# EAGLE schematic SensorBoard (EAGLE 9.1.3)
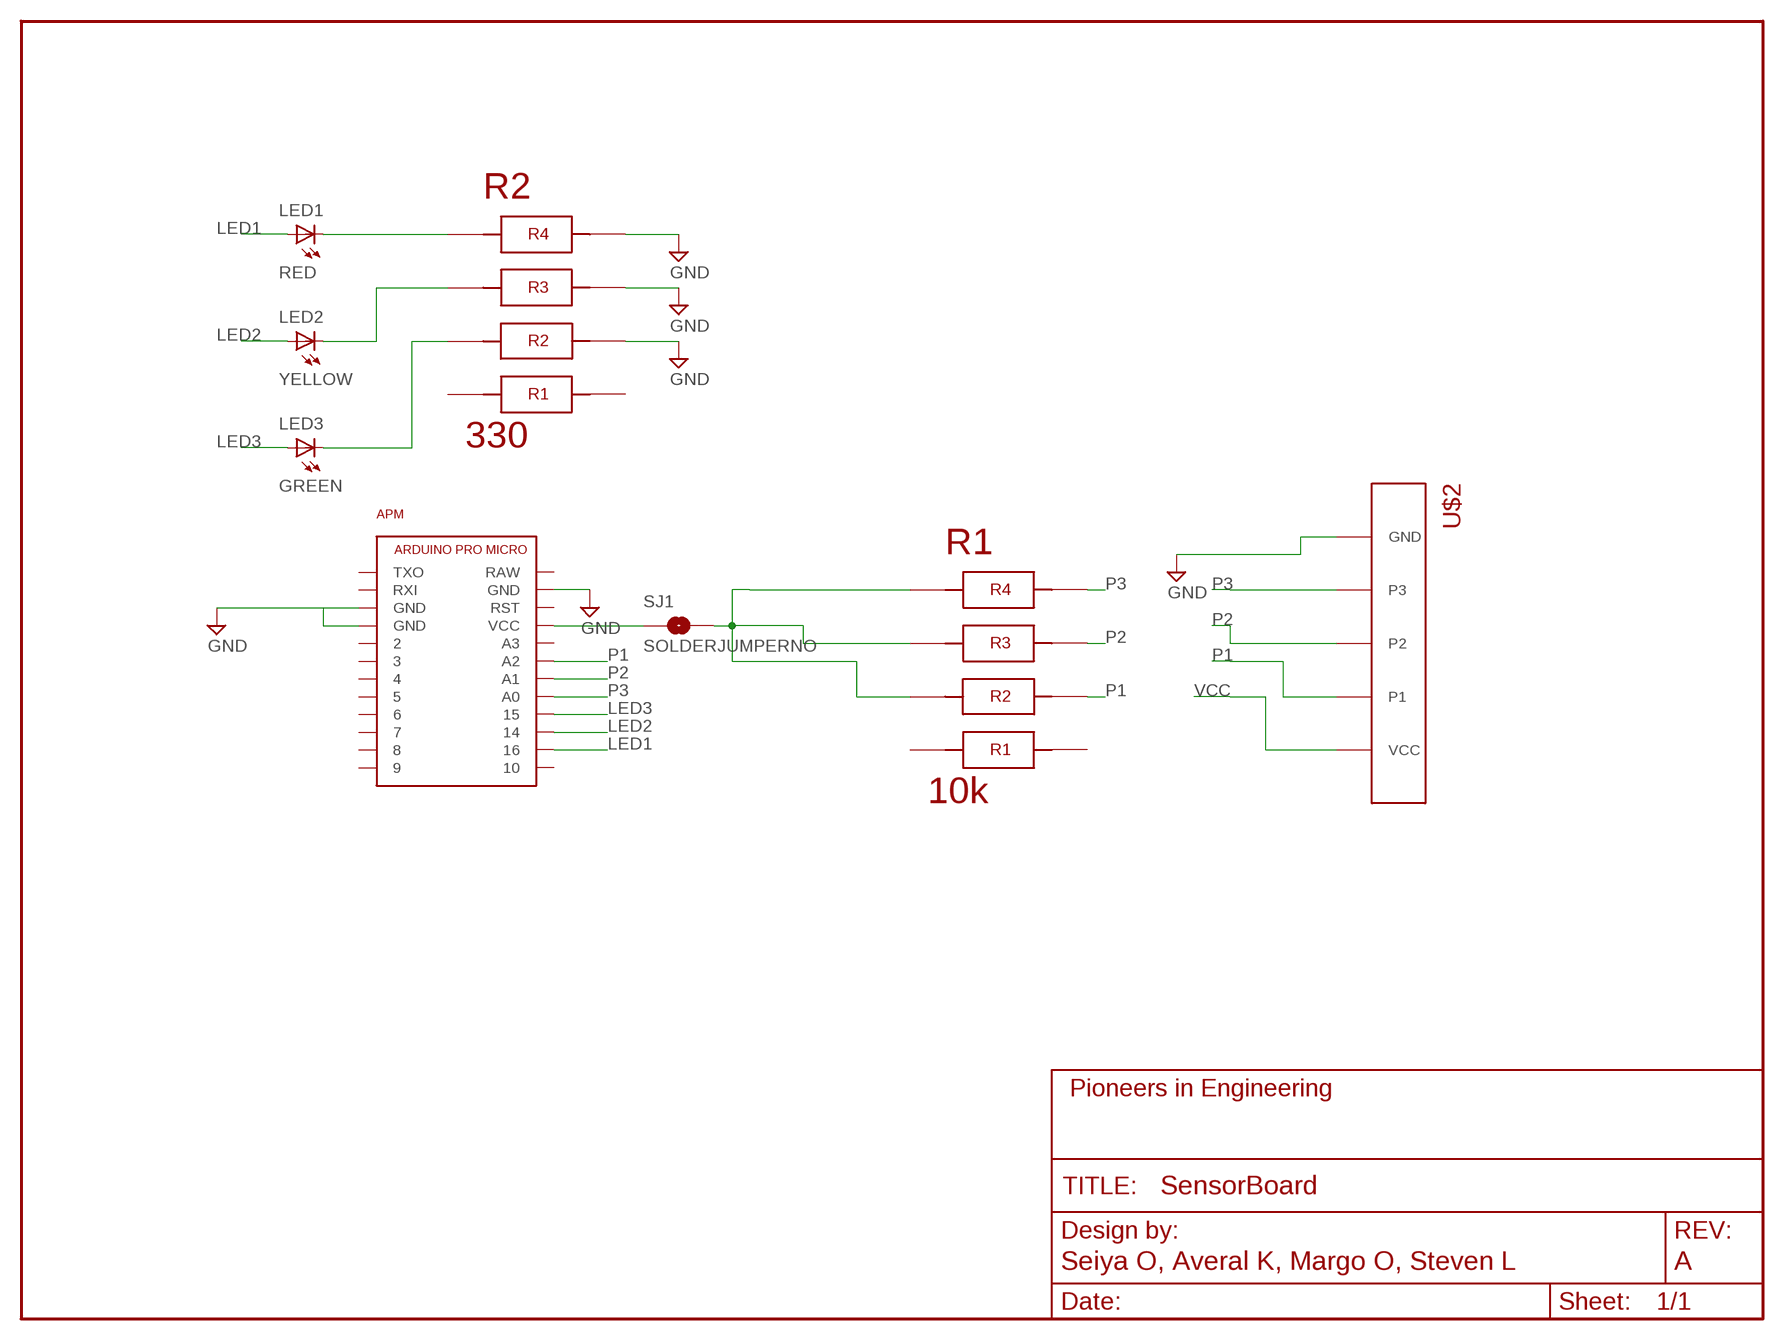
[diagram p0: schematic, sheet 1]
FRAME1 (FRAME_SCHEMATIC): AUTHOR: Seiya O, Averal K, Margo O, Steven L; REVISION: A

## Parts
APM  ARDUINO_PRO_MICRO  [ARDUINO_PRO_MICRO]
LED1  RED  LED1206  [LED-1206]
LED2  YELLOW  LED1206  [LED-1206]
LED3  GREEN  LED1206  [LED-1206]
R1  10k  4X-0603  [4X-0603]
R2  330  4X-0603  [4X-0603]
SJ1  SOLDERJUMPERNO  [SJ_2S-NO]
U$2  5PIN  [5PIN]

## Nets
5V: R1.5 R1.6 R1.7 SJ1.2
GND: APM.GND@0(GND) APM.GND@1(GND) APM.GND@2(GND) R2.2 R2.3 R2.4 U$2.GND
LED1: APM.16 LED1.A
LED2: APM.14 LED2.A
LED3: APM.15 LED3.A
N$1: LED2.C R2.6
N$2: LED1.C R2.5
N$6: LED3.C R2.7
P1: APM.A2 R1.2 U$2.P1
P2: APM.A1 R1.3 U$2.P2
P3: APM.A0 R1.4 U$2.P3
VCC: APM.VCC SJ1.1 U$2.VCC
Unconnected: APM.2 APM.3 APM.4 APM.5 APM.6 APM.7 APM.8 APM.9 APM.10 APM.A3 APM.RAW APM.RST APM.RXI APM.TXO R1.1 R1.8 R2.1 R2.8

## Library data of the parts
APM = pie:ARDUINO_PRO_MICRO: Arduino Pro Micro Electrical System Year 9's Smart Sensor Core Pin Outs <https://cdn.sparkfun.com/assets/9/c/3/c/4/523a1765757b7f5c6e8b4567.png> Buy Here <http://www.aliexpress.com/item/Mini-Leonardo-Pro-Micro-ATmega32U4-5V-16MHz-Module-For-Arduino-Best-Quality/32284746884.html?ws_ab_test=searchweb201556_8,searchweb201602_2_10057_10056_10065_10055_10054_10067_10069_10059_10058_10017_10070_10060_10061_10052_10062_10053_10050_10051,searchweb201603_1&btsid=45993952-29ca-4de4-a0fb-c7fb72b8e1a5> Thru Hole Female Pins <http://www.digikey.com/product-search/en?keywords=929974E-01-12-ND> Surface Mount Female Pins <http://www.digikey.com/product-detail/en/sullins-connector-solutions/NPTC121KFXC-RC/S5604-ND/776062>; DESCRIPTION: Arduino Pro Micro; DISTRIBUTOR: AliExpress; DISTRIBUTOR_PART_NUMBER: 32284746884; MANUFACTURER: Feiyang electronics; NOTES: https://www.aliexpress.com/item/Mini-Leonardo-Pro-Micro-ATmega32U4-5V-16MHz-Module-For-Arduino-Best-Quality/32284746884.html?ws_ab_test=searchweb201556_8,searchweb201602_2_10057_10056_10065_10055_10054_10067_10069_10059_10058_10017_10070_10060_10061_10052_10062_10053_10050_10051,searchweb201603_1&btsid=45993952-29ca-4de4-a0fb-c7fb72b8e1a5; PACKAGE: ARDUINO_PRO_MICRO; REFERENCE_DEST: ARDUINO_PRO_MICRO
LED1-LED3 = pie:LED: LEDs Standard schematic elements and footprints for 5mm, 3mm, 1206, and 0603 sized LEDs. 5mm - Spark Fun Electronics SKU : COM-00529 (and others); PIE-INT-REF-NUM: LED
R1 R2 = pie:4X-0603: 330: https://www.digikey.com/product-detail/en/panasonic-electronic-components/EXB-38V331JV/Y9331CT-ND/256586 10k: https://www.digikey.com/product-detail/en/panasonic-electronic-components/EXB-38V103JV/Y9103CT-ND/256604
SJ1 = pie:SOLDERJUMPER: Solder Jumper Standard SMD solder jumper. Used to automate production. Two varients : Normally Open and Normally Closed are the same, but have different paste layers. NC will have a large amount of paste and should jumper during reflow.; PIE-INT-REF-NUM: DNL
U$2 = pie:5PIN